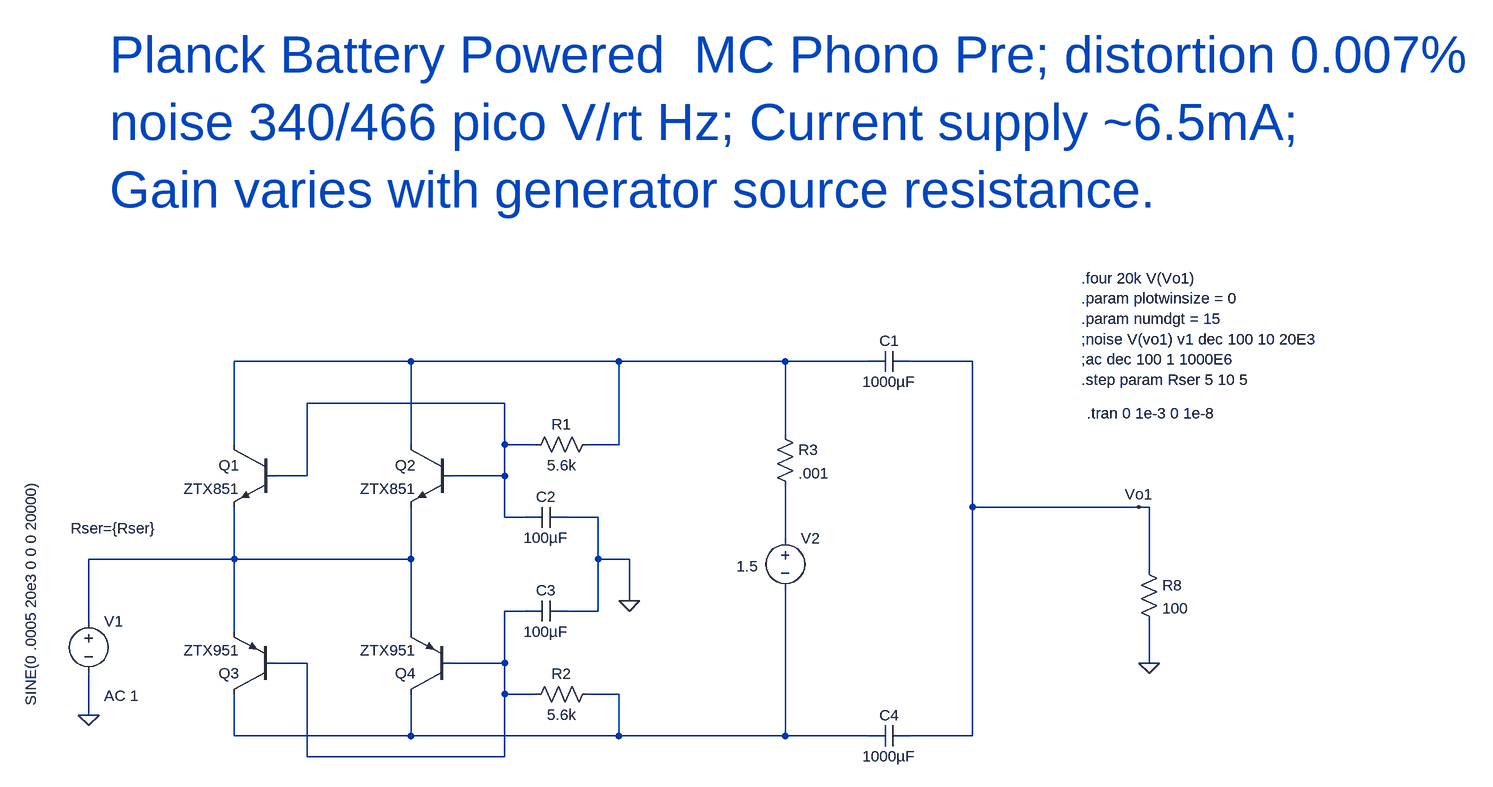
[diagram p0: schematic Planck.asc]
Planck.asc, the LTspice schematic file:
Version 4
SHEET 1 2304 680
WIRE -144 -160 -416 -160
WIRE 176 -160 -144 -160
WIRE 432 -160 176 -160
WIRE 560 -160 432 -160
WIRE 720 -160 624 -160
WIRE 0 -96 -304 -96
WIRE 432 -48 432 -160
WIRE -416 -32 -416 -160
WIRE -144 -32 -144 -160
WIRE 0 -32 0 -96
WIRE 48 -32 0 -32
WIRE 176 -32 176 -160
WIRE 176 -32 128 -32
WIRE -304 16 -304 -96
WIRE -304 16 -352 16
WIRE 0 16 0 -32
WIRE 0 16 -80 16
WIRE 720 64 720 -160
WIRE 976 64 720 64
WIRE 992 64 976 64
WIRE 0 80 0 16
WIRE 32 80 0 80
WIRE 144 80 96 80
WIRE 432 112 432 32
WIRE -416 144 -416 64
WIRE -416 144 -640 144
WIRE -144 144 -144 64
WIRE -144 144 -416 144
WIRE 144 144 144 80
WIRE 192 144 144 144
WIRE 992 160 992 64
WIRE 192 208 192 144
WIRE 32 224 0 224
WIRE 144 224 144 144
WIRE 144 224 96 224
WIRE -640 240 -640 144
WIRE -416 256 -416 144
WIRE -144 256 -144 144
WIRE -304 304 -352 304
WIRE 0 304 0 224
WIRE 0 304 -80 304
WIRE 992 304 992 240
WIRE 0 352 0 304
WIRE 48 352 0 352
WIRE 176 352 128 352
WIRE -640 384 -640 320
WIRE -416 416 -416 352
WIRE -144 416 -144 352
WIRE -144 416 -416 416
WIRE 176 416 176 352
WIRE 176 416 -144 416
WIRE 432 416 432 192
WIRE 432 416 176 416
WIRE 560 416 432 416
WIRE 720 416 720 64
WIRE 720 416 624 416
WIRE -304 448 -304 304
WIRE 0 448 0 352
WIRE 0 448 -304 448
FLAG 976 64 Vo1
FLAG -640 384 0
FLAG 192 208 0
FLAG 992 304 0
SYMBOL voltage -640 224 R0
WINDOW 3 -89 -203 VRight 2
WINDOW 123 24 130 Left 2
WINDOW 39 -28 -127 Left 2
SYMATTR Value SINE(0 .0005 20e3 0 0 0 20000)
SYMATTR Value2 AC 1
SYMATTR SpiceLine Rser={Rser}
SYMATTR InstName V1
SYMBOL voltage 432 96 R0
WINDOW 3 -75 59 Left 2
WINDOW 123 24 130 Left 2
WINDOW 39 0 0 Left 2
SYMATTR Value 1.5
SYMATTR InstName V2
SYMBOL res 976 144 R0
SYMATTR InstName R8
SYMATTR Value 100
SYMBOL npn -352 -32 M0
SYMATTR InstName Q1
SYMATTR Value ZTX851
SYMBOL npn -80 -32 M0
SYMATTR InstName Q2
SYMATTR Value ZTX851
SYMBOL pnp -352 352 R180
SYMATTR InstName Q3
SYMATTR Value ZTX951
SYMBOL pnp -80 352 R180
SYMATTR InstName Q4
SYMATTR Value ZTX951
SYMBOL res 144 -48 R90
WINDOW 0 0 56 VBottom 2
WINDOW 3 32 56 VTop 2
SYMATTR InstName R1
SYMATTR Value 5.6k
SYMBOL res 144 336 R90
WINDOW 0 0 56 VBottom 2
WINDOW 3 32 56 VTop 2
SYMATTR InstName R2
SYMATTR Value 5.6k
SYMBOL cap 96 64 R90
WINDOW 0 0 32 VBottom 2
WINDOW 3 32 32 VTop 2
SYMATTR InstName C2
SYMATTR Value 100µF
SYMBOL cap 96 208 R90
WINDOW 0 0 32 VBottom 2
WINDOW 3 32 32 VTop 2
SYMATTR InstName C3
SYMATTR Value 100µF
SYMBOL cap 624 -176 R90
WINDOW 0 0 32 VBottom 2
WINDOW 3 32 32 VTop 2
SYMATTR InstName C1
SYMATTR Value 1000µF
SYMBOL cap 624 400 R90
WINDOW 0 0 32 VBottom 2
WINDOW 3 32 32 VTop 2
SYMATTR InstName C4
SYMATTR Value 1000µF
SYMBOL res 416 -64 R0
SYMATTR InstName R3
SYMATTR Value .001
TEXT 896 -80 Left 2 !.tran 0 1e-3 0 1e-8
TEXT 888 -288 Left 2 !.four 20k V(Vo1)\n.param plotwinsize = 0\n.param numdgt = 15\n;noise V(vo1) v1 dec 100 10 20E3\n;ac dec 100 1 1000E6\n.step param Rser 5 10 5
TEXT -608 -632 Left 6 ;Planck Battery Powered  MC Phono Pre; distortion 0.007%\nnoise 340/466 pico V/rt Hz; Current supply ~6.5mA;\nGain varies with generator source resistance.

The netlist it stands for:
* Planck.asc
V1 N004 0 SINE(0 .0005 20e3 0 0 0 20000) AC 1 Rser={Rser}
V2 N003 N006 1.5
R8 Vo1 0 100
Q1 N001 N002 N004 0 ZTX851
Q2 N001 N002 N004 0 ZTX851
Q3 N006 N005 N004 0 ZTX951
Q4 N006 N005 N004 0 ZTX951
R1 N001 N002 5.6k
R2 N006 N005 5.6k
C2 0 N002 100µF
C3 0 N005 100µF
C1 Vo1 N001 1000µF
C4 Vo1 N006 1000µF
R3 N001 N003 .001
.model NPN NPN
.model PNP PNP
.lib standard.bjt
.tran 0 1e-3 0 1e-8
.four 20k V(Vo1)
.param plotwinsize = 0
.param numdgt = 15
;noise V(vo1) v1 dec 100 10 20E3
;ac dec 100 1 1000E6
.step param Rser 5 10 5
* Planck Battery Powered  MC Phono Pre; distortion 0.007%
* noise 340/466 pico V/rt Hz; Current supply ~6.5mA;
* Gain varies with generator source resistance.
.backanno
.end